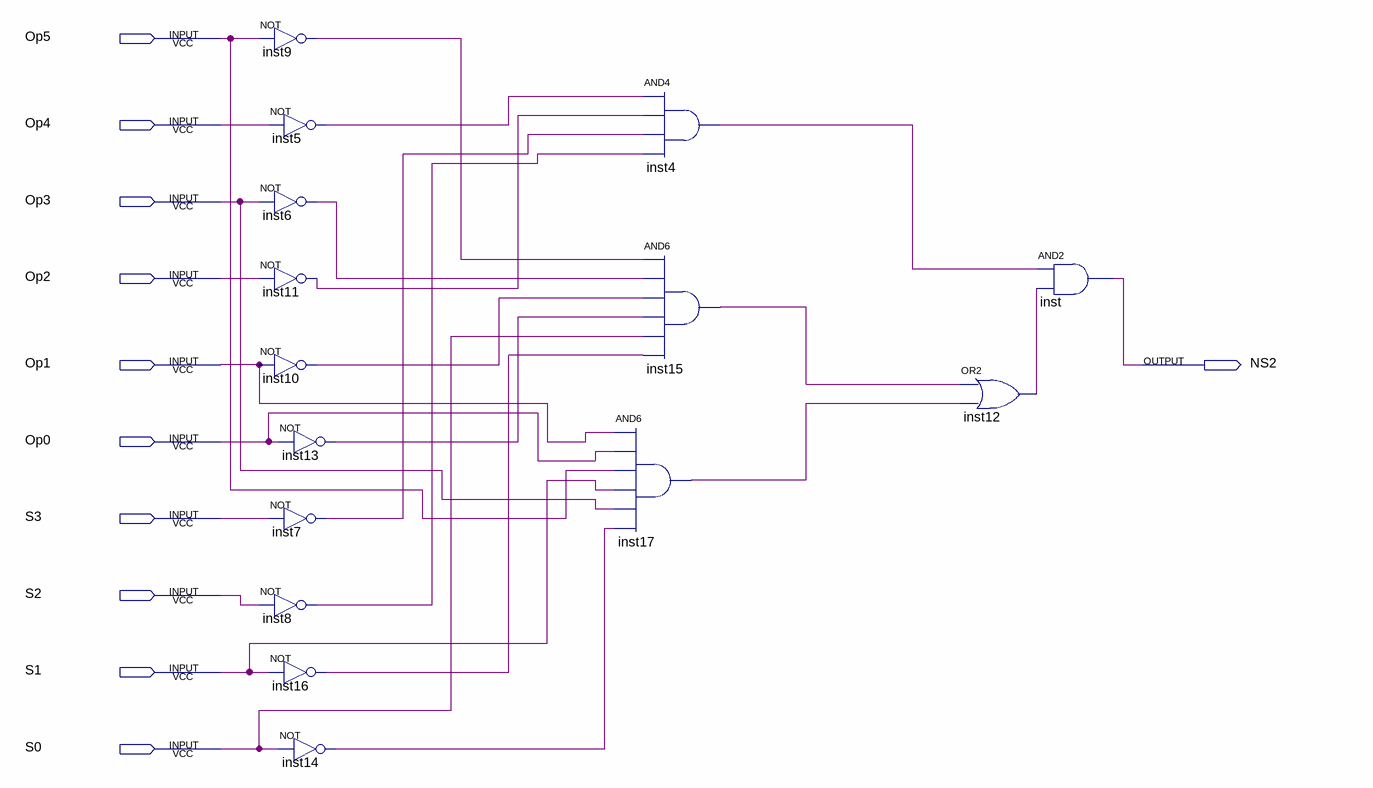
[diagram p0: schematic sheet]
// Quartus schematic NS2.bdf as structural Verilog: 15 symbols, 11 pins
module NS2 (
  input  Op5,
  input  Op4,
  input  Op3,
  input  Op2,
  input  Op1,
  input  Op0,
  input  S3,
  input  S2,
  input  S1,
  input  S0,
  output NS2
);

  wire inst4_out, inst5_out, inst6_out, inst7_out, inst8_out, inst9_out, inst10_out, inst11_out, inst12_out,
       inst13_out, inst14_out, inst15_out, inst16_out, inst17_out;

  not inst9 (inst9_out, Op5);
  not inst5 (inst5_out, Op4);
  not inst6 (inst6_out, Op3);
  not inst11 (inst11_out, Op2);
  not inst10 (inst10_out, Op1);
  not inst13 (inst13_out, Op0);
  not inst7 (inst7_out, S3);
  not inst8 (inst8_out, S2);
  not inst16 (inst16_out, S1);
  not inst14 (inst14_out, S0);
  and inst4 (inst4_out, inst5_out, inst11_out, inst7_out, inst8_out);
  and inst15 (inst15_out, inst9_out, inst6_out, inst10_out, inst13_out, S0, inst16_out);
  and inst17 (inst17_out, Op1, Op0, Op5, S1, Op3, inst14_out);
  or inst12 (inst12_out, inst15_out, inst17_out);
  and inst (NS2, inst4_out, inst12_out);
endmodule
